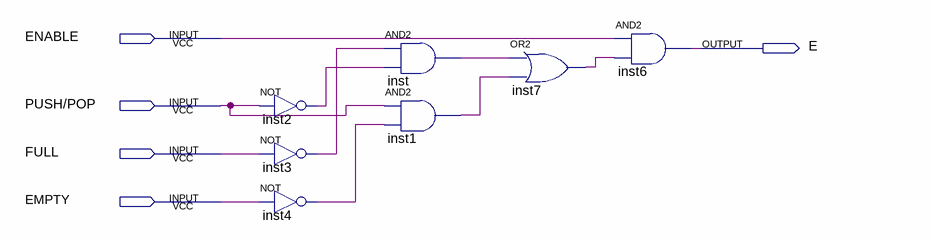
[diagram p0: schematic sheet]
// Quartus schematic ENBLOCK.bdf as structural Verilog: 7 symbols, 5 pins
module ENBLOCK (
  input  ENABLE,
  input  \PUSH/POP ,
  input  FULL,
  input  EMPTY,
  output E
);

  wire inst1_out, inst2_out, inst3_out, inst4_out, inst7_out, inst_out;

  not inst2 (inst2_out, \PUSH/POP );
  not inst3 (inst3_out, FULL);
  not inst4 (inst4_out, EMPTY);
  and inst (inst_out, inst3_out, inst2_out);
  and inst1 (inst1_out, \PUSH/POP , inst4_out);
  or inst7 (inst7_out, inst_out, inst1_out);
  and inst6 (E, ENABLE, inst7_out);
endmodule
